# Altium schematic sheet Sheet1.SchDoc
size A3; SheetNumber: 1; SheetTotal: 1
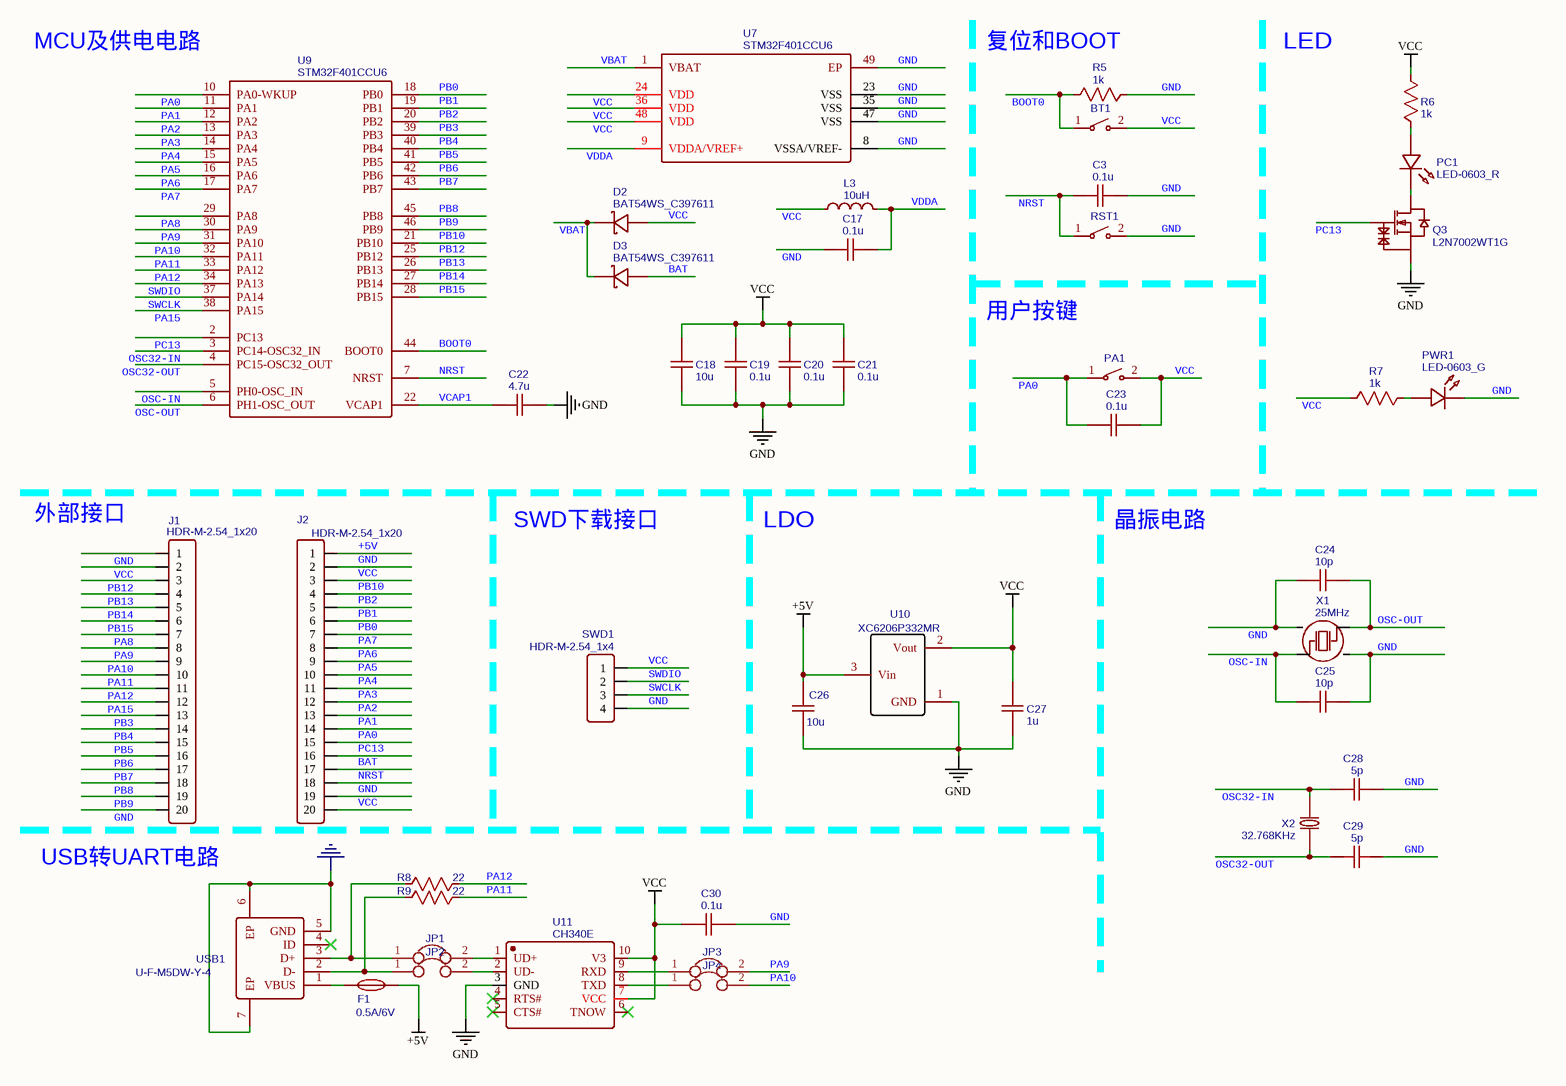
[diagram p0: Sheet1.SchDoc]

## Parts
BT1  TS-1088R-02026  [SW-SMD_L3.9-W3.0-P4.45]  (value not drawn)
C3  0.1u  [0603]
C17  0.1u  [0603]
C18  10u  [0603]
C19  0.1u  [0603]
C20  0.1u  [0603]
C21  0.1u  [0603]
C22  4.7u  [0603]
C23  0.1u  [0603]
C24  10p  [0603]
C25  10p  [0603]
C26  10u  [0603]
C27  1u  [0603]
C28  5p  [0603]
C29  5p  [0603]
C30  0.1u  [0603]
D2  BAT54WS_C397611
D3  BAT54WS_C397611
F1  0.5A/6V  [F0603]
J1  HDR-M-2.54_1x20  [HDR-M-2.54_1X20]
J2  HDR-M-2.54_1x20  [HDR-M-2.54_1X20]
JP1  JUMPER  [JUMPER-0603]  (value not drawn)
JP2  JUMPER  [JUMPER-0603]  (value not drawn)
JP3  JUMPER  [JUMPER-0603]  (value not drawn)
JP4  JUMPER  [JUMPER-0603]  (value not drawn)
L3  10uH  [L0805]
PA1  TS-1088R-02026  [SW-SMD_L3.9-W3.0-P4.45]  (value not drawn)
PC1  LED-0603_R  [LED0603_RED]
PWR1  LED-0603_G  [LED0603_GREEN]
Q3  L2N7002WT1G  [SC-70-3_L2.1-W1.3-P1.30-LS2.1-BR]
R5  1k  [R0603]
R6  1k  [R0603]
R7  1k  [R0603]
R8  22  [R0603]
R9  22  [R0603]
RST1  TS-1088R-02026  [SW-SMD_L3.9-W3.0-P4.45]  (value not drawn)
SWD1  HDR-M-2.54_1x4  [HDR-M-2.54_1X4]
U7  STM32F401CCU6  [UFQFPN-48_L7.0-W7.0-P0.50-BL-EP]
U9  STM32F401CCU6  [UFQFPN-48_L7.0-W7.0-P0.50-BL-EP]
U10  XC6206P332MR  [SOT-23(SOT-23-3)]
U11  CH340E  [MSOP-10_L3.0-W3.0-P0.50-LS5.0-BL]
USB1  U-F-M5DW-Y-4  [MICRO-USB-A12]
X1  25MHz  [OSC-SMD_4P-L3.2-W2.5-BL]
X2  32.768KHz  [OSC-SMD_L3.2-W1.5]

## Nets
+5V: C26.2 F1.2 J2.1 U10.3(Vin)
GND: C3.1 C17.2 C18.1 C19.1 C20.1 C21.1 C22.2 C24.1 C25.2 C26.1 C27.1 C28.1 C29.1 C30.1 J1.1 J1.20 J2.2 J2.19 PWR1.2 Q3.2(S) R5.2 RST1.2 SWD1.4 U7.8(VSSA/VREF-) U7.23(VSS) U7.35(VSS) U7.47(VSS) U7.49(EP) U10.1(GND) U11.3(GND) USB1.5(GND) USB1.6(EP) USB1.7(EP) X1.2 X1.4
VCC: BT1.2 C18.2 C19.2 C20.2 C21.2 C23.1 C27.2 C30.2 D2.2(A) J1.2 J2.3 J2.20 L3.1 PA1.2 R6.2 R7.2 SWD1.1 U7.24(VDD) U7.36(VDD) U7.48(VDD) U10.2(Vout) U11.7(VCC) U11.10(V3)
BAT: D3.2(A) J2.17
BOOT0: BT1.1 R5.1 U9.44(BOOT0)
NRST: C3.2 J2.18 RST1.1 U9.7(NRST)
OSC32-IN: C28.2 U9.3(PC14-OSC32_IN) X2.2
OSC32-OUT: C29.2 U9.4(PC15-OSC32_OUT) X2.1
OSC-IN: C25.1 U9.5(PH0-OSC_IN) X1.1
OSC-OUT: C24.2 U9.6(PH1-OSC_OUT) X1.3
PA0: C23.2 J2.15 PA1.1 U9.10(PA0-WKUP)
PA1: J2.14 U9.11(PA1)
PA2: J2.13 U9.12(PA2)
PA3: J2.12 U9.13(PA3)
PA4: J2.11 U9.14(PA4)
PA5: J2.10 U9.15(PA5)
PA6: J2.9 U9.16(PA6)
PA7: J2.8 U9.17(PA7)
PA8: J1.7 U9.29(PA8)
PA9: J1.8 JP3.2 U9.30(PA9)
PA10: J1.9 JP4.2 U9.31(PA10)
PA11: J1.10 R9.2 U9.32(PA11)
PA12: J1.11 R8.2 U9.33(PA12)
PA15: J1.12 U9.38(PA15)
PB0: J2.7 U9.18(PB0)
PB1: J2.6 U9.19(PB1)
PB2: J2.5 U9.20(PB2)
PB3: J1.13 U9.39(PB3)
PB4: J1.14 U9.40(PB4)
PB5: J1.15 U9.41(PB5)
PB6: J1.16 U9.42(PB6)
PB7: J1.17 U9.43(PB7)
PB8: J1.18 U9.45(PB8)
PB9: J1.19 U9.46(PB9)
PB10: J2.4 U9.21(PB10)
PB12: J1.3 U9.25(PB12)
PB13: J1.4 U9.26(PB13)
PB14: J1.5 U9.27(PB14)
PB15: J1.6 U9.28(PB15)
PC13: J2.16 Q3.1(G) U9.2(PC13)
SWCLK: SWD1.3 U9.37(PA14)
SWDIO: SWD1.2 U9.34(PA13)
VBAT: D2.1(C) D3.1(C) U7.1(VBAT)
VCAP1: C22.1 U9.22(VCAP1)
VDDA: C17.1 L3.2 U7.9(VDDA/VREF+)
NetF1_1: F1.1 USB1.1(VBUS)
NetJP1_1: JP1.1 R8.1 USB1.3(D+)
NetJP1_2: JP1.2 U11.1(UD+)
NetJP2_1: JP2.1 R9.1 USB1.2(D-)
NetJP2_2: JP2.2 U11.2(UD-)
NetJP3_1: JP3.1 U11.9(RXD)
NetJP4_1: JP4.1 U11.8(TXD)
NetPC1_1: PC1.1 R6.1
NetPC1_2: PC1.2 Q3.3(D)
NetPWR1_1: PWR1.1 R7.1

Not connected (* = marked no-connect by the designer): U11 4(RTS#)* 5(CTS#)* 6(TNOW)*; USB1 4(ID)*

## Notes on the sheet
- MCU及供电电路
- (near R5) 复位和BOOT
- LED
- 用户按键
- 外部接口
- SWD下载接口
- LDO
- 晶振电路
- (near J1) USB转UART电路

## Library data of the parts
BT1 PA1 RST1 = TS-1088R-02026: BOM_Manufacturer: XUNPU; Contributor: LCSC; BOM_Supplier: LCSC; BOM_Supplier Part: C455280; BOM_Manufacturer Part: TS-1088R-02026; spicePre: S; spiceSymbolName: TS-1088R-02026
C3 C17 C19-C21 C23 = 0.1u: nameAlias: Value(F); Contributor: LCEDA_Lib; spicePre: C; spiceSymbolName: C_0402_US
C18 = 10u: nameAlias: Value(F); Contributor: LCEDA_Lib; spicePre: C; spiceSymbolName: C_0805_US
C22 = 4.7u: nameAlias: Value(F); Contributor: LCEDA_Lib; spicePre: C; spiceSymbolName: C_0402_US
C24 C25 = 10p: nameAlias: Value(F); Contributor: LCEDA_Lib; spicePre: C; spiceSymbolName: C_0402_US
C26 = 10u: nameAlias: Value(F); spicePre: C; spiceSymbolName: Cap_0805_US
C27 = 1u: nameAlias: Value(F); spicePre: C; spiceSymbolName: Cap_RAD-0.1_US
C28 C29 = 5p: nameAlias: Value(F); Contributor: LCEDA_Lib; spicePre: C; spiceSymbolName: C_0402_US
C30 = 0.1u: nameAlias: Value(F); spicePre: C; spiceSymbolName: Cap_0805_US
D2 D3 = BAT54WS_C397611: BOM_Manufacturer: AnBon; Contributor: LCSC; BOM_Supplier: LCSC; BOM_Supplier Part: C397611; BOM_Manufacturer Part: BAT54WS; spicePre: D; spiceSymbolName: BAT54WS_C397611
F1 = 0.5A/6V: BOM_Manufacturer: BOURNS; BOM_Manufacturer Part: MF-FSMF050X-2; Contributor: LCSC; BOM_Supplier: LCSC; BOM_Supplier Part: C210357; spicePre: F; spiceSymbolName: MF-FSMF050X-2
J1 J2 = HDR-M-2.54_1x20: Contributor: LCEDA_Lib; BOM_Supplier Part: C50981; BOM_Supplier: LCSC; spicePre: J; spiceSymbolName: HDR-M-2.54_1x20
L3 = 10uH: BOM_Manufacturer: microgate; BOM_Manufacturer Part: MGFI2012D100KT-LF; nameAlias: Inductance; Contributor: LCSC; BOM_Supplier: LCSC; BOM_Supplier Part: C281097; spicePre: L; spiceSymbolName: MGFI2012D100KT-LF
PC1 = LED-0603_R: BOM_Manufacturer: EVERLIGHT(台湾亿光); BOM_Manufacturer Part: 19-217/R6C-AL1M2VY/3T; Contributor: LCEDA_01; BOM_Supplier Part: C72044; BOM_Supplier: LCSC; spicePre: L; spiceSymbolName: LED-0603_R
PWR1 = LED-0603_G: BOM_Manufacturer: EVERLIGHT(台湾亿光); BOM_Manufacturer Part: 19-217/GHC-YR1S2/3T; Contributor: LCEDA_Lib; BOM_Supplier Part: C72043; BOM_Supplier: LCSC; spicePre: L; spiceSymbolName: LED-0603_G
Q3 = L2N7002WT1G: BOM_Manufacturer: LRC; SMT Type: Extend; BOM_Supplier: LCSC; BOM_Manufacturer Part: L2N7002WT1G; BOM_Supplier Part: C12778; BOM_LCSC Assembly: Yes; spicePre: Q; spiceSymbolName: L2N7002WT1G
R5-R7 = 1k: nameAlias: Value(Ω); Contributor: LCEDA_Lib; spicePre: R; spiceSymbolName: R_0402_US
R8 R9 = 22: nameAlias: Value(Ω); Contributor: LCEDA_Lib; spicePre: R; spiceSymbolName: R_0603_US
SWD1 = HDR-M-2.54_1x4: Contributor: LCEDA_Lib; BOM_Supplier Part: C124378; BOM_Supplier: LCSC; spicePre: J; spiceSymbolName: HDR-M-2.54_1x4
U7 U9 = STM32F401CCU6: BOM_Manufacturer: ST; subpart_no: 1; tags: STM32; BOM_Supplier Part: C79861; BOM_Supplier: LCSC; BOM_Manufacturer Part: STM32F401CCU6; spicePre: U; spiceSymbolName: STM32F401CCU6
U10 = XC6206P332MR: BOM_Manufacturer: TOREX; SMT Type: Basic; BOM_Supplier: LCSC; BOM_Manufacturer Part: XC6206P332MR; BOM_LCSC Assembly: Yes; image: //image.lceda.cn/szlcsc/C5446.jpg; BOM_Supplier Part: C5446; spicePre: U
U11 = CH340E: BOM_Manufacturer: WCH; SMT Type: Extend; BOM_Supplier: LCSC; BOM_Manufacturer Part: CH340E; BOM_Supplier Part: C99652; BOM_LCSC Assembly: Yes; spicePre: U; spiceSymbolName: CH340E
USB1 = U-F-M5DW-Y-4: BOM_Manufacturer: HRO; Contributor: LCSC; BOM_Supplier: LCSC; BOM_Manufacturer Part: U-F-M5DW-Y-4; BOM_Supplier Part: C145784; spicePre: U
X1 = 25MHz: BOM_Manufacturer: Zhejiang Abel Elec; BOM_Manufacturer Part: TAXM8M4RDBCCT2T; nameAlias: Frequency; Contributor: LCSC; SMT Type: Extend; BOM_Supplier: LCSC; BOM_Supplier Part: C400090; BOM_LCSC Assembly: Yes; spicePre: X; spiceSymbolName: TAXM8M4RDBCCT2T
X2 = 32.768KHz: BOM_Manufacturer: EPSON; BOM_Manufacturer Part: Q13FC1350004900; nameAlias: Frequency; BOM_Supplier: LCSC; BOM_Supplier Part: C95361; spicePre: X; spiceSymbolName: Q13FC1350004900
JP1-JP4 = JUMPER: spicePre: J; spiceSymbolName: JUMPER